# Altium schematic sheet modulesx1278.SchDoc
size A
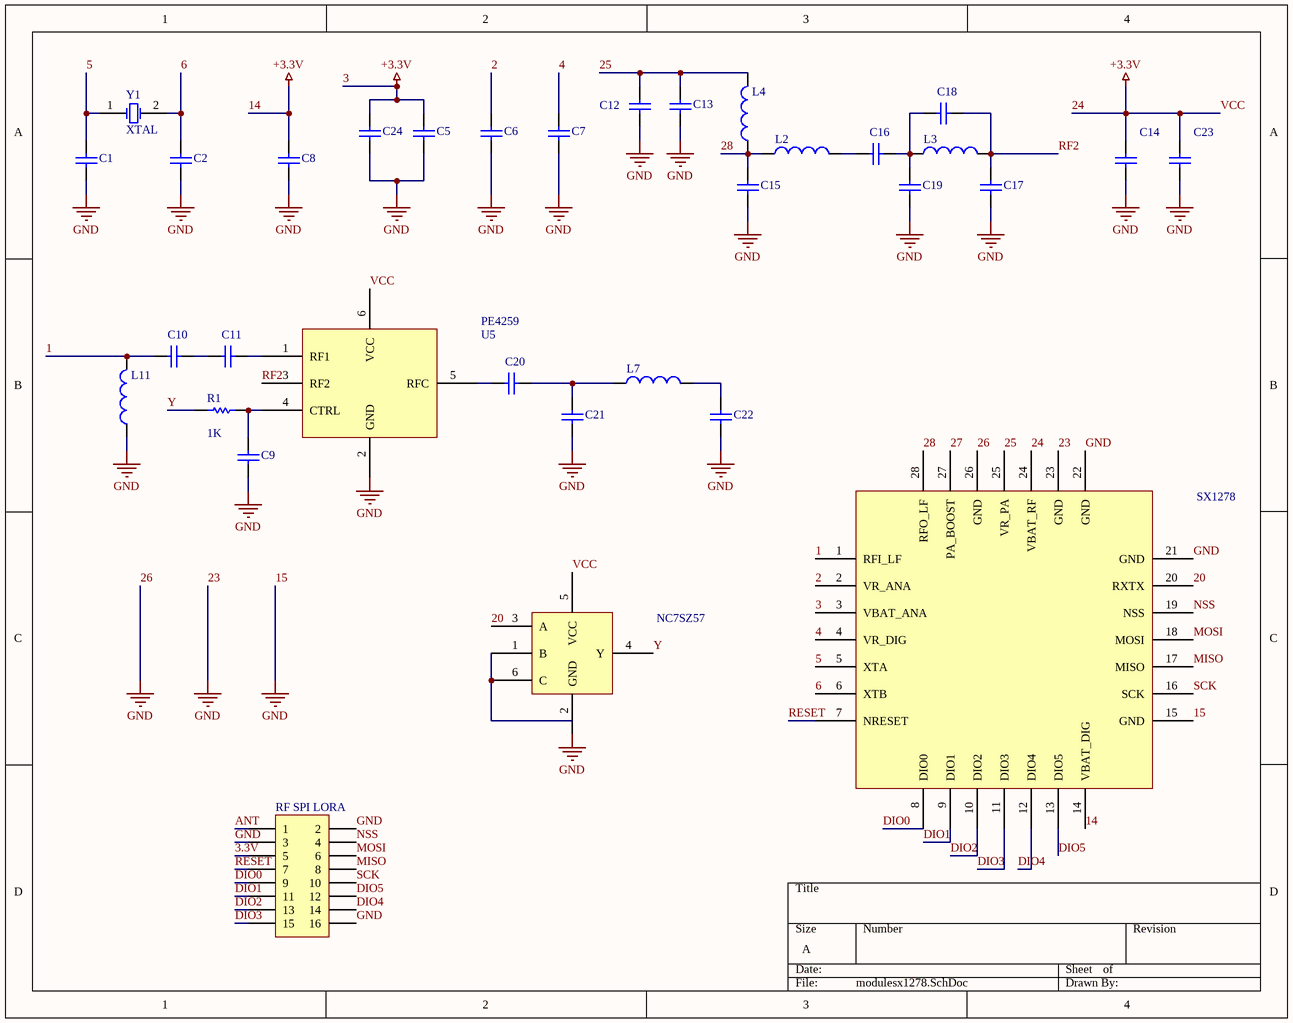
[diagram p0: modulesx1278.SchDoc]

## Parts
*  SX1278
?  NC7SZ57
C1  Cap  [RAD-0.3]  (value not drawn)
C2  Cap  [RAD-0.3]  (value not drawn)
C5  Cap  [RAD-0.3]  (value not drawn)
C6  Cap  [RAD-0.3]  (value not drawn)
C7  Cap  [RAD-0.3]  (value not drawn)
C8  Cap  [RAD-0.3]  (value not drawn)
C9  Cap  [RAD-0.3]  (value not drawn)
C10  Cap  [RAD-0.3]  (value not drawn)
C11  Cap  [RAD-0.3]  (value not drawn)
C12  Cap  [RAD-0.3]  (value not drawn)
C13  Cap  [RAD-0.3]  (value not drawn)
C14  Cap  [RAD-0.3]  (value not drawn)
C15  Cap  [RAD-0.3]  (value not drawn)
C16  Cap  [RAD-0.3]  (value not drawn)
C17  Cap  [RAD-0.3]  (value not drawn)
C18  Cap  [RAD-0.3]  (value not drawn)
C19  Cap  [RAD-0.3]  (value not drawn)
C20  Cap  [RAD-0.3]  (value not drawn)
C21  Cap  [RAD-0.3]  (value not drawn)
C22  Cap  [RAD-0.3]  (value not drawn)
C23  Cap  [RAD-0.3]  (value not drawn)
C24  Cap  [RAD-0.3]  (value not drawn)
L2  Inductor  [0402-A]  (value not drawn)
L3  Inductor  [0402-A]  (value not drawn)
L4  Inductor  [0402-A]  (value not drawn)
L7  Inductor  [0402-A]  (value not drawn)
L11  Inductor  [0402-A]  (value not drawn)
PE4259  U5
R1  value 1K  [AXIAL-0.3]  (hidden comment: Res1)
RF_SPI_LORA  Header 8X2  [HDR2X8]  (value not drawn)
Y1  XTAL  [R38]

## Nets
14: *.3(VBAT_ANA) *.14(VBAT_DIG) *.24(VBAT_RF) ?.5(VCC) C5.2 C8.2 C14.2 C23.2 C24.2 PE4259.6(VCC)  [also labelled +3.3V, 24, 3, VCC]
15: *.15(GND) *.21(GND) *.22(GND) *.23(GND) *.26(GND) ?.2(GND) C1.1 C2.1 C5.1 C6.1 C7.1 C8.1 C9.1 C12.1 C13.1 C14.1 C15.1 C17.1 C19.1 C21.2 C22.2 C23.1 C24.1 L11.1 PE4259.2(GND) RF_SPI_LORA.2 RF_SPI_LORA.3 RF_SPI_LORA.16  [also labelled 23, 26, GND]
1: *.1(RFI_LF) C10.2 L11.2
2: *.2(VR_ANA) C6.2
3.3V: RF_SPI_LORA.5
4: *.4(VR_DIG) C7.2
5: *.5(XTA) C1.2 Y1.1(OSC1)
6: *.6(XTB) C2.2 Y1.2(OSC2)
20: *.20(RXTX) ?.3(A)
25: *.25(VR_PA) C12.2 C13.2 L4.2
27: *.27(PA_BOOST)
28: *.28(RFO_LF) C15.2 L2.1 L4.1
ANT: RF_SPI_LORA.1
DIO0: *.8(DIO0) RF_SPI_LORA.9
DIO1: *.9(DIO1) RF_SPI_LORA.11
DIO2: *.10(DIO2) RF_SPI_LORA.13
DIO3: *.11(DIO3) RF_SPI_LORA.15
DIO4: *.12(DIO4) RF_SPI_LORA.14
DIO5: *.13(DIO5) RF_SPI_LORA.12
MISO: *.17(MISO) RF_SPI_LORA.8
MOSI: *.18(MOSI) RF_SPI_LORA.6
NSS: *.19(NSS) RF_SPI_LORA.4
RESET: *.7(NRESET) RF_SPI_LORA.7
RF2: C17.2 C18.1 L3.2 PE4259.3(RF2)
SCK: *.16(SCK) RF_SPI_LORA.10
Y: ?.4(Y) R1.1
Net?_1: ?.1(B) ?.6(C)
NetC9_2: C9.2 PE4259.4(CTRL) R1.2
NetC10_1: C10.1 C11.2
NetC11_1: C11.1 PE4259.1(RF1)
NetC16_1: C16.1 C18.2 C19.2 L3.1
NetC16_2: C16.2 L2.2
NetC20_1: C20.1 C21.1 L7.1
NetC20_2: C20.2 PE4259.5(RFC)
NetC22_1: C22.1 L7.2

## Library data of the parts
C1 C2 C5-C24 = Cap: Capacitor; Value: 100pF; Published: 8-Jun-2000; LatestRevisionDate: 17-Jul-2002; LatestRevisionNote: Re-released for DXP Platform.; PackageReference: RAD-0.3; Publisher: Altium Limited; PackageDescription: Radial Cap, Thru-Hole; 2 Leads; 0.3 in Pin Spacing
L2-L4 L7 L11 = Inductor: Code_IEC: 1005; Value: 10mH; Published: 8-Jun-2000; LatestRevisionDate: 29-May-2009; LatestRevisionNote: IPC-7351 Footprint Added.; PackageReference: 0402-A; Publisher: Altium Limited; PackageDescription: Chip Inductor; Code_JEITA: 0402
R1 = Res1: Resistor; Published: 8-Jun-2000; LatestRevisionDate: 17-Jul-2002; LatestRevisionNote: Re-released for DXP Platform.; PackageReference: AXIAL-0.3; Publisher: Altium Limited; PackageDescription: Axial Device, Thru-Hole; 2 Leads; 0.3 in Pin Spacing
RF_SPI_LORA = Header 8X2: Header, 8-Pin, Dual row; LatestRevisionDate: 17-Jul-2002; LatestRevisionNote: Re-released for DXP Platform.; Publisher: Altium Limited
Y1 = XTAL: Crystal Oscillator; Published: 8-Jun-2000; LatestRevisionDate: 17-Jul-2002; LatestRevisionNote: Re-released for DXP Platform.; PackageReference: R38; Publisher: Altium Limited; PackageDescription: Crystal, Thru-Hole; 2 Leads; Body 3.1 x 8.2 mm (Dia.xH)